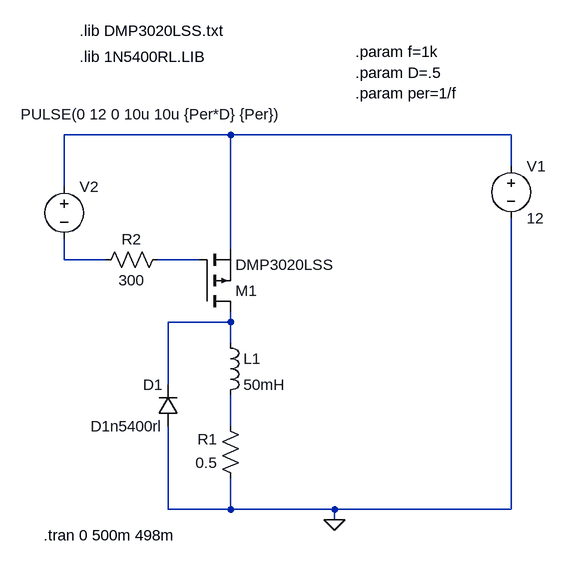
[diagram p0: schematic dmp3020lss_switch.asc]
dmp3020lss_switch.asc, the LTspice schematic file:
Version 4
SHEET 1 1256 680
WIRE 768 -544 512 -544
WIRE 1200 -544 768 -544
WIRE 1200 -496 1200 -544
WIRE 512 -464 512 -544
WIRE 768 -368 768 -544
WIRE 512 -352 512 -384
WIRE 576 -352 512 -352
WIRE 720 -352 656 -352
WIRE 768 -256 768 -272
WIRE 768 -256 672 -256
WIRE 768 -224 768 -256
WIRE 672 -160 672 -256
WIRE 768 -96 768 -144
WIRE 672 32 672 -96
WIRE 768 32 768 -16
WIRE 768 32 672 32
WIRE 928 32 768 32
WIRE 1200 32 1200 -416
WIRE 1200 32 928 32
WIRE 928 48 928 32
FLAG 928 48 0
SYMBOL pmos 720 -272 M180
SYMATTR InstName M1
SYMATTR Value DMP3020LSS
SYMATTR Prefix X
SYMBOL ind 752 -240 R0
SYMATTR InstName L1
SYMATTR Value 50mH
SYMBOL res 784 0 R180
WINDOW 0 36 76 Left 2
WINDOW 3 36 40 Left 2
SYMATTR InstName R1
SYMATTR Value 0.5
SYMBOL voltage 1200 -512 R0
WINDOW 123 0 0 Left 0
WINDOW 39 0 0 Left 0
SYMATTR InstName V1
SYMATTR Value 12
SYMBOL voltage 512 -480 R0
WINDOW 123 0 0 Left 0
WINDOW 39 0 0 Left 0
WINDOW 3 -67 -96 Left 2
SYMATTR InstName V2
SYMATTR Value PULSE(0 12 0 10u 10u {Per*D} {Per})
SYMBOL diode 688 -96 R180
WINDOW 0 24 64 Left 2
WINDOW 3 24 0 Left 2
SYMATTR InstName D1
SYMATTR Value D1n5400rl
SYMBOL res 672 -368 R90
WINDOW 0 0 56 VBottom 2
WINDOW 3 32 56 VTop 2
SYMATTR InstName R2
SYMATTR Value 300
TEXT 536 -704 Left 2 !.lib DMP3020LSS.txt
TEXT 480 72 Left 2 !.tran 0 500m 498m
TEXT 536 -664 Left 2 !.lib 1N5400RL.LIB
TEXT 960 -672 Left 2 !.param f=1k
TEXT 960 -640 Left 2 !.param D=.5
TEXT 960 -608 Left 2 !.param per=1/f

The netlist it stands for:
* dmp3020lss_switch.asc
XM1 N004 N003 N001 DMP3020LSS  ; pins D G S
L1 N004 N005 50mH
R1 0 N005 0.5
V1 N001 0 12
V2 N001 N002 PULSE(0 12 0 10u 10u {Per*D} {Per})
D1 0 N004 D1n5400rl
R2 N003 N002 300
.model D D
.lib standard.dio
.lib DMP3020LSS.txt
.tran 0 500m 498m
.lib 1N5400RL.LIB
.param f=1k
.param D=.5
.param per=1/f
.backanno
.end